# EAGLE schematic arduino (EAGLE 6.3)
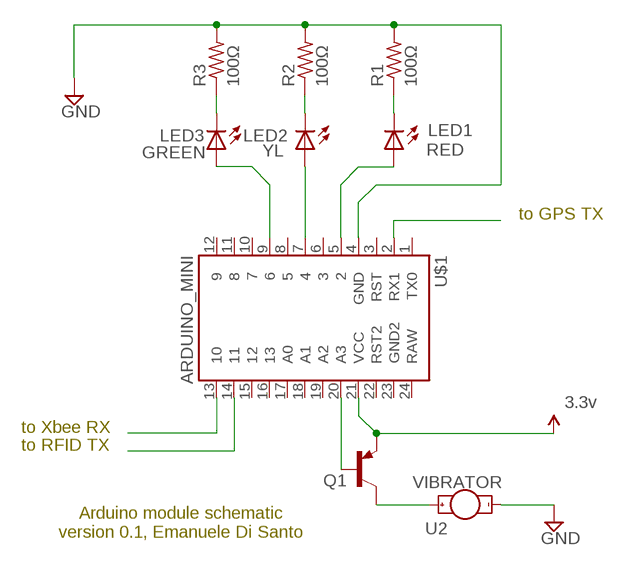
[diagram p0: schematic, sheet 1]

## Parts
LED1  RED  LEDCHIPLED_0805  [CHIPLED_0805]
LED2  YL  LEDCHIPLED_0805  [CHIPLED_0805]
LED3  GREEN  LEDCHIPLED_0805  [CHIPLED_0805]
Q1  -PNP-TO92  [TO92]
R1  100Ω  R-US_R3216  [R3216]
R2  100Ω  R-US_R3216  [R3216]
R3  100Ω  R-US_R3216  [R3216]
U2  VIBRATOR  MOTOR10MM  [VIBE-MOTOR-10MM]
U$1  ARDUINO_MINI  [ARDUINO_MINI]

## Nets
GND: R1.2 R2.2 R3.2 U2.- U$1.4(GND)
N$1: LED1.C R1.1
N$2: LED1.A U$1.5
N$3: LED2.C R2.1
N$4: LED3.C R3.1
N$5: LED2.A U$1.7
N$6: LED3.A U$1.9
N$7: U$1.13
N$8: U$1.14
N$9: U$1.2(RX1)
N$10: Q1.2(B) U$1.20(A3)
N$11: Q1.3(C) U2.+
VCC: Q1.1(E) U$1.21(VCC) ; supply symbol labelled 3.3v
Unconnected: U$1.1(TX0) U$1.3(RST) U$1.6 U$1.8 U$1.10 U$1.11 U$1.12 U$1.15 U$1.16 U$1.17(A0) U$1.18(A1) U$1.19(A2) U$1.22(RST2) U$1.23(GND2) U$1.24(RAW)

## Notes on the sheet
- to GPS TX
- to Xbee RX
- to RFID TX
- Arduino module schematic
  version 0.1, Emanuele Di Santo

## Library data of the parts
LED1-LED3 = led:LED: LED OSRAM: - CHIPLED LG R971, LG N971, LY N971, LG Q971, LY Q971, LO R971, LY R971 LH N974, LH R974 LS Q976, LO Q976, LY Q976 LO Q996 - Hyper CHIPLED LW Q18S LB Q993, LB Q99A, LB R99A - SideLED LS A670, LO A670, LY A670, LG A670, LP A670 LB A673, LV A673, LT A673, LW A673 LH A674 LY A675 LS A676, LA A676, LO A676, LY A676, LW A676 LS A679, LY A679, LG A679 - Hyper Micro SIDELED® LS Y876, LA Y876, LO Y876, LY Y876 LT Y87S - SmartLED LW L88C, LW L88S LB L89C, LB L89S, LG L890 LS L89K, LO L89K, LY L89K LS L896, LA L896, LO L896, LY L896 - TOPLED LS T670, LO T670, LY T670, LG T670, LP T670 LSG T670, LSP T670, LSY T670, LOP T670, LYG T670 LG T671, LOG T671, LSG T671 LB T673, LV T673, LT T673, LW T673 LH T674 LS T676, LA T676, LO T676, LY T676, LB T676, LH T676, LSB T676, LW T676 LB T67C, LV T67C, LT T67C, LS T67K, LO T67K, LY T67K, LW E67C LS E67B, LA E67B, LO E67B, LY E67B, LB E67C, LV E67C, LT E67C LW T67C LS T679, LY T679, LG T679 LS T770, LO T770, LY T770, LG T770, LP T770 LB T773, LV T773, LT T773, LW T773 LH T774 LS E675, LA E675, LY E675, LS T675 LS T776, LA T776, LO T776, LY T776, LB T776 LHGB T686 LT T68C, LB T68C - Hyper Mini TOPLED® LB M676 - Mini TOPLED Santana® LG M470 LS M47K, LO M47K, LY M47K Source: http://www.osram.convergy.de LUXEON: - LUMILED® LXK2-PW12-R00, LXK2-PW12-S00, LXK2-PW14-U00, LXK2-PW14-V00 LXK2-PM12-R00, LXK2-PM12-S00, LXK2-PM14-U00 LXK2-PE12-Q00, LXK2-PE12-R00, LXK2-PE12-S00, LXK2-PE14-T00, LXK2-PE14-U00 LXK2-PB12-K00, LXK2-PB12-L00, LXK2-PB12-M00, LXK2-PB14-N00, LXK2-PB14-P00, LXK2-PB14-Q00 LXK2-PR12-L00, LXK2-PR12-M00, LXK2-PR14-Q00, LXK2-PR14-R00 LXK2-PD12-Q00, LXK2-PD12-R00, LXK2-PD12-S00 LXK2-PH12-R00, LXK2-PH12-S00 LXK2-PL12-P00, LXK2-PL12-Q00, LXK2-PL12-R00 Source: www.luxeon.com KINGBRIGHT: KA-3528ASYC Source: www.kingbright.com
Q1 = transistor:*-PNP-: PNP Transistror
R1-R3 = resistor:R-US_: RESISTOR, American symbol
U2 = SparkFun-Electromechanical:MOTOR: Vibration Motor- ROB-08449 Physical dimension and wire connections for this powerful vibration motor. Motor has a self adhesive backing.
U$1 = SparkFun-Boards:ARDUINO_MINI: Arduino Pro Mini footprint